# EAGLE design LB_i6_dimmer-v03(3_3) (EAGLE 6.6.0)
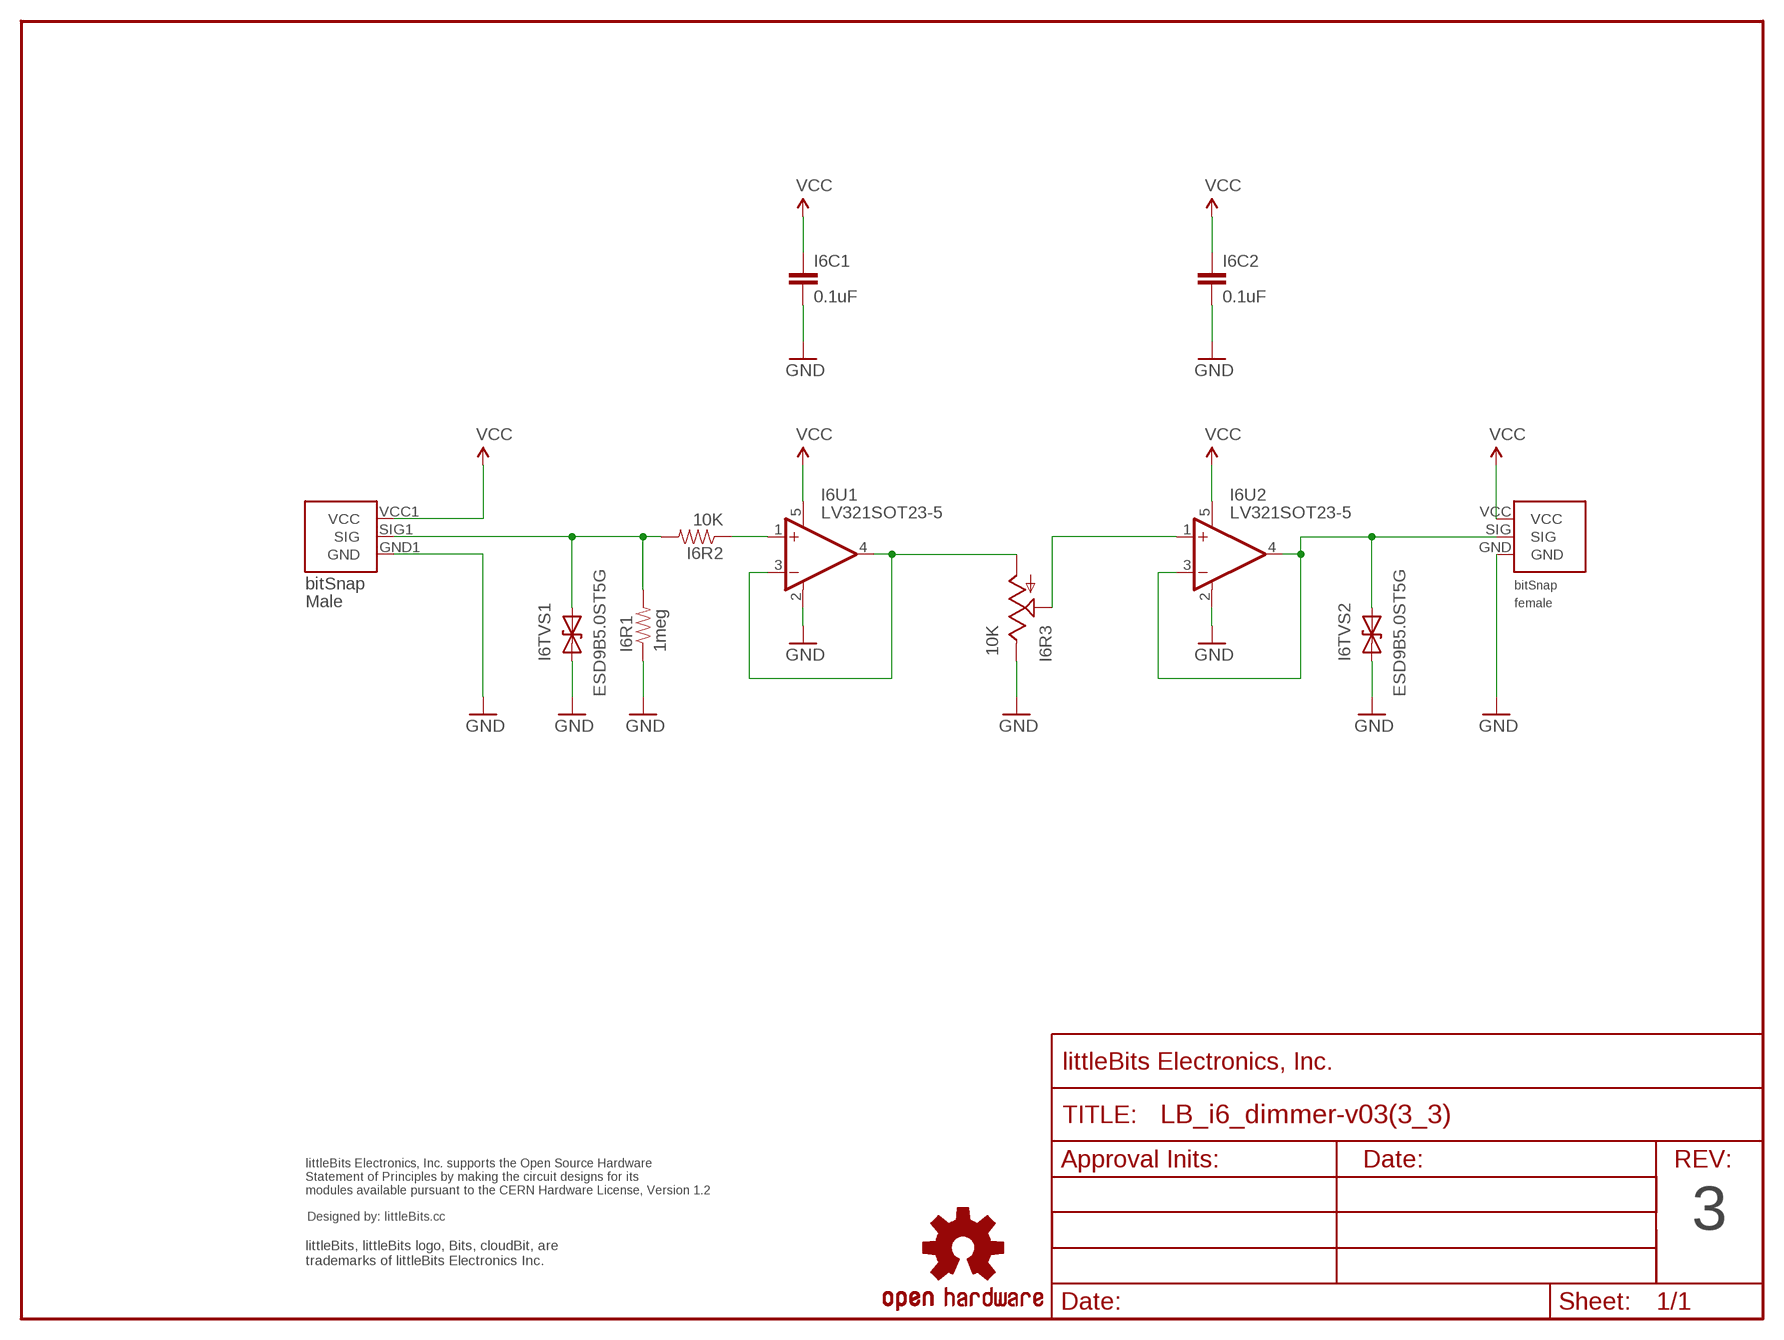
[diagram p0: schematic, sheet 1]

## Parts
FRAME1  FRAME-LETTER-OHWOHW  [FABDWG01-OHW]
I6BSF1  BITSNAP_V03_FEMALE  [BITSNAP_V03_FEMALE]
I6BSM1  BITSNAP_V03_MALE  [BITSNAP_V03_MALE]
I6C1  0.1uF  CAPCAP-0603  [CAP-0603]
I6C2  0.1uF  CAPCAP-0603  [CAP-0603]
I6R1  1meg  RESISTOR0603  [RES-0603]
I6R2  10K  RESISTOR0603  [RES-0603]
I6R3  10K  POT  [ALPS_POT]
I6TVS1  ESD9B5.0ST5G  DIODE-TVSSOD-923  [SOD-923]
I6TVS2  ESD9B5.0ST5G  DIODE-TVSSOD-923  [SOD-923]
I6U1  LV321SOT23-5  [SOT23-5]
I6U2  LV321SOT23-5  [SOT23-5]
U$3  OSHW-LOGOL  [OSHW-LOGO-L]
U$4  LB_CREDITS  [OSHWCREDIT]

## Nets
GND: I6BSF1.GND I6BSM1.GND1(GND) I6C1.2 I6C2.2 I6R1.1 I6R3.P$1(E) I6TVS1.1(A) I6TVS2.1(A) I6U1.2(V-) I6U2.2(V-)
N$1: I6R3.P$3(A) I6U1.3(-IN) I6U1.4(OUT)
N$2: I6R2.1 I6U1.1(+IN)
N$3: I6BSF1.SIG I6TVS2.2(C) I6U2.3(-IN) I6U2.4(OUT)
N$4: I6R3.P$2(S) I6U2.1(+IN)
SIG: I6BSM1.SIG1(SIG) I6R1.2 I6R2.2 I6TVS1.2(C)
VCC: I6BSF1.VCC I6BSM1.VCC1(VCC) I6C1.1 I6C2.1 I6U1.5(V+) I6U2.5(V+)

## Notes on the sheet
- 3

## Library data of the parts
FRAME1 = LITTLEBITS:FRAME-LETTER-OHW
I6BSF1 = bitSnap:BITSNAP_V03_FEMALE
I6BSM1 = bitSnap:BITSNAP_V03_MALE
I6C1 I6C2 = LITTLEBITS:CAP
I6R1 I6R2 = LITTLEBITS:RESISTOR
I6R3 = SparkFun:POT
I6TVS1 I6TVS2 = LITTLEBITS:DIODE-TVS: Bidirectional Transient Voltage Suppression Diode: Device conducts in avalanche mode after reaching a part dependent voltage threshold. Used for limiting voltage spikes on ESD sensitive inputs and outputs.; IEC_ESD_PROT0: +/-18kV; LB_PN: ?; MPN: ESD9B5.0ST5G; V_CLAMP: ?; V_OPERATION: 5V
I6U1 I6U2 = LITTLEBITS:LV321
U$3 = LITTLEBITS:OSHW-LOGO: Open Source Hardware Logo This logo indicates the piece of hardware it is found on incorporates a OSHW license and/or adheres to the definition of open source hardware found here: http://freedomdefined.org/OSHW
U$4 = LITTLEBITS:LB_CREDITS

## Board
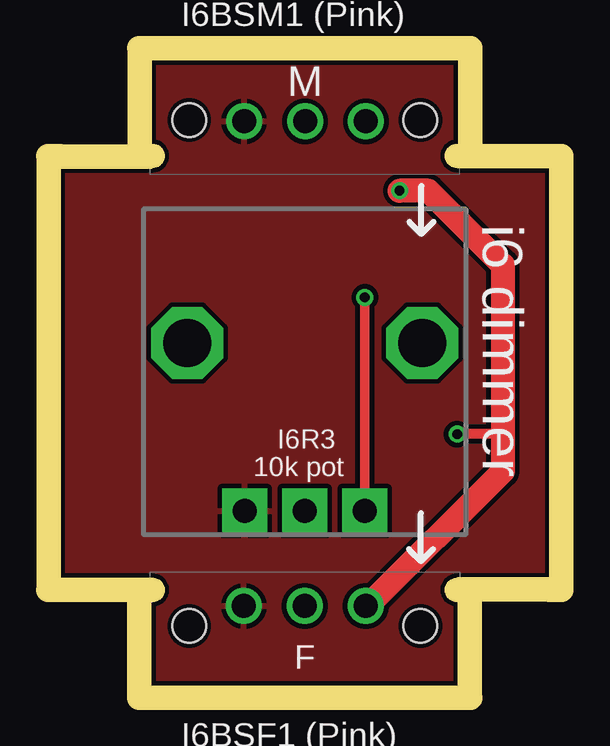
[diagram p1: board, top side]
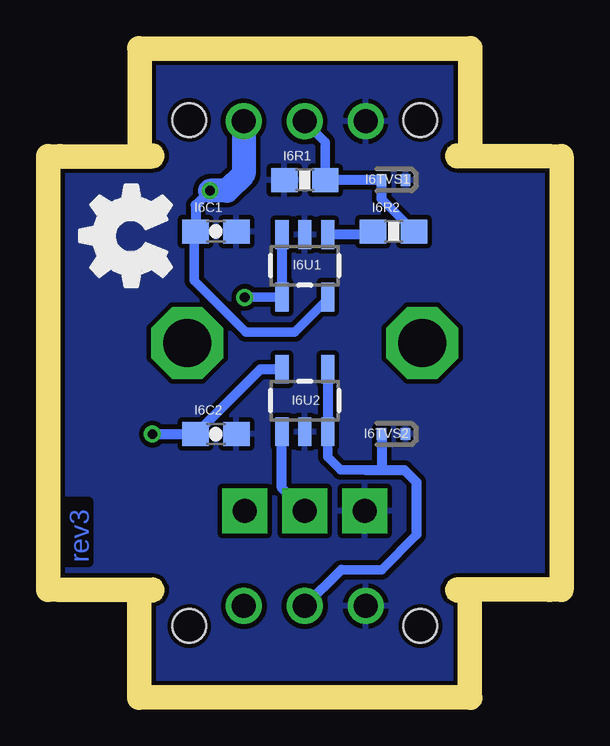
[diagram p2: board, bottom side, seen from below]

Size 20.4 x 26.1 mm. Coordinates in mm from the lower left corner, seen from the top.
Outline: 0,21.6 0,4.5
Outline: 20.4,4.5 20.4,21.6
Copper layers (1*16): Top 0.035mm / dielectric 1.5mm / Bottom 0.035mm
Design rules "default": minimum track width 0.2mm, minimum drill 0.4mm, track to track 0.2mm, track to pad 0.2mm, pad to pad 0.2mm, via to via 0.2mm, smd to smd 0mil, copper to edge 0.2mm, drill to drill 0.2mm, minimum pad ring 0.2mm, minimum via ring 0.15mm, stop-mask expansion 0.1mm, vias tented up to drill 0mil, thermal gap 0.2mm
Milling: 6 lines

### Footprints (pad centres in the part's own frame; a part is rotated, then mirrored left to right if it is on the bottom)
BITSNAP_V03_FEMALE = drill 1: GND 3.91,3.33; SIG 6.45,3.33; VCC 8.99,3.33 | hole 1.4: 1.63,2.5; 11.27,2.5
BITSNAP_V03_MALE = drill 1: GND1 8.98,2.56; SIG1 6.44,2.56; VCC1 3.9,2.56 | hole 1.4: 11.27,2.5; 1.63,2.5
CAP-0603 = smd 1.1 x 1: 1 -0.85,0; 2 0.85,0
RES-0603 = smd 1.1 x 1: 1 -0.85,0; 2 0.85,0
ALPS_POT = drill 1 pad 1.88 square: P$1 7,-2.5; P$2 7,0; P$3 7,2.5 | drill 2 octagon: P$4 0,-4.9; P$5 0,4.9
SOD-923 = smd 0.4 x 0.5: 1 -0.5,0; 2 0.5,0
SOT23-5 = smd 0.55 x 1.2: 1 -0.95,-1.3; 2 0,-1.3; 3 0.95,-1.3; 4 0.95,1.3; 5 -0.95,1.3

### Placement (x,y rotation side)
FRAME1  0,0 0 top
I6BSF1  3.75,0 0 top
I6BSM1  16.65,26.1 180 top
I6C1  13.9,18.95 0 bottom
I6C2  13.9,10.5 0 bottom
I6R1  10.2,21.1 0 bottom
I6R2  6.5,18.95 0 bottom
I6R3  10.2,14.3 270 top
I6TVS1  6.5,21.1 180 bottom
I6TVS2  6.5,10.5 180 bottom
I6U1  10.2,17.52 180 bottom
I6U2  10.2,11.9 0 bottom
U$1  [OSHW_FILLX150_NOTEXT]  15.76,15.81 0 top
U$3  -25.09,-71.09 0 top  (outside the outline)
U$4  -93.88,-56.83 0 top  (outside the outline)

### Tracks (layer width: path | path; a pad name or v marks a point on that pad's centre or on a via)
GND
  pour Top: 0.15,25.97 0.15,0.15 20.27,0.15 20.27,25.97
  pour Bottom: 0.15,25.97 0.15,0.15 20.27,0.15 20.27,25.97
N$1  (via drill 0.41)
  Top 0.405: v12.7,16.2 I6R3.P$3 12.7,7.25
  Bottom 0.405: I6U1.4 12.68,16.22 v12.7,16.2
  Bottom 0.406: I6U1.3 I6U1.4
N$2
  Bottom 0.406: I6R2.1 7.48,18.82 I6U1.1
N$3
  Bottom 0.405: 9.2,10.5 9.2,10.55 9.25,10.55 I6U2.3 9.25,9.55 8.7,9 7.65,9 | 8.68,4.85 7,4.85 5.55,6.3
  Bottom 0.406: I6U2.4 I6U2.3 | 7.65,9 7,9 | 7,9 6.05,9 5.55,8.5 5.55,6.3 | I6BSF1.SIG 8.68,4.85 | I6TVS2.2 7,9
N$4
  Bottom 0.406: I6R3.P$2 11.15,8.25 I6U2.1
SIG
  Bottom 0.405: 7,20.3 I6R2.2 | I6R1.2 9.35,22.68 I6BSM1.SIG1
  Bottom 0.406: 7,20.3 I6TVS1.2 I6R1.2
VCC  (via drill 0.41)
  Top 0.406: 18.45,10.5 v16.55,10.5
  Top 1: I6BSF1.VCC 12.83,3.33 18.45,8.95 18.45,10.5 18.45,17.55 15.35,20.65 v14.15,20.65
  Bottom 0.405: I6C1.1 14.8,18.9 14.8,16.9 12.65,14.75 10.62,14.75 9.28,16.09 9.28,16.22 I6U1.5
  Bottom 0.406: I6U2.5 12.05,13.2 I6C2.1 14.8,10.5 | v16.55,10.5 14.8,10.5 | 14.8,10.5 14.75,10.45 | v14.15,20.65 14.75,20.05 I6C1.1
  Bottom 1: I6BSM1.VCC1 12.75,21.35 13.45,20.65 v14.15,20.65

### Text on the board
Bottom: rev3
tPlace: i6 dimmer
tNames: I6BSM1 (Pink) | I6R3 | 10k pot | I6BSF1 (Pink)
Milling: 1mm DIA. ROUTER PATH
dxf: 3 | Rotary dimmer bit